# Altium schematic sheet USB_SCH.SchDoc
size A; SheetNumber: 9; SheetTotal: 9
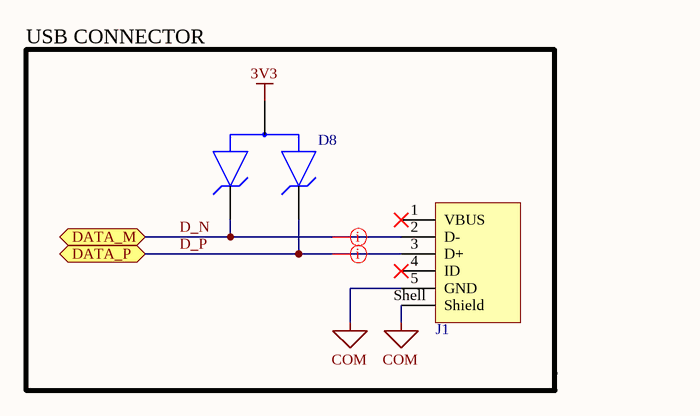
[diagram p0: USB_SCH.SchDoc]

## Parts
D8  RCLAMP0502BATCT  [FP-SC75-MFG]  (value not drawn)
J1  629105150521  [629105150521]  (value not drawn)

## Ports
DATA_M (bidir), DATA_P (bidir)

## Nets
3V3: D8.3(COMMON_ANODE)
COM: J1.5(GND) J1.Shell(Shield)
D_N: D8.2(2_CATHODE) J1.2(D-) ; port DATA_M
D_P: D8.1(1_CATHODE) J1.3(D+) ; port DATA_P

Not connected (* = marked no-connect by the designer): J1 1(VBUS)* 4(ID)*

## Layout directives
differential pair; differential pair class 90_Ohm: D_N, D_P

## Notes on the sheet
- USB CONNECTOR
- (near J1) VBUS si je veux alimenter le board par usb, mettre un circuit pour pas fry l'ordi

## Library data of the parts
D8 = CMP-56445-000003-1: TVS DIODE 5VWM 25VC SC75
J1 = 629105150521: WR-Micro USB 2.0 Type B, Receptacle, Horizontal, SMT, with Pegs; Manufacturer: Wurth Elektronik; Match Code: WR-USB; Interface Type: Type B; Number of Ports: 1; Rated Current: 3A; Working Voltage: 30VAC; ComponentLink1Description: Website Link; ComponentLink1URL: https://www.we-online.com/redexpert/article/629105150521?ad; ComponentLink2Description: Datasheet Link; ComponentLink2URL: https://www.we-online.com/redexpert/spec/629105150521?ad; Manufacturer Part Number: 629105150521; Category: Input/Output Connectors; Mount: Surface Mount; Operating Temperature Max: 85°C; Operating Temperature Min: -40°C; Packaging: Tape and Reel; Application: Micro USB 2.0; Gender: Receptacle; Number of Pins: 5; Orientation: Horizontal; Supplier 1: RSComponents; Supplier Part Number 1: 1225099